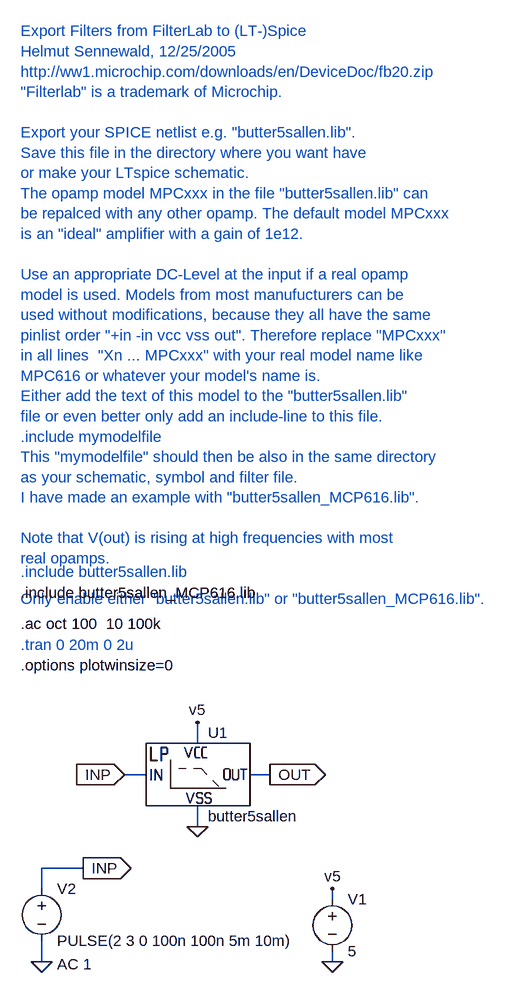
[diagram p0: schematic MC_filterlab__lp1khz.asc]
MC_filterlab__lp1khz.asc, the LTspice schematic file:
Version 4
SHEET 1 880 680
WIRE -112 416 -112 384
WIRE -112 528 -112 496
WIRE -48 384 -112 384
WIRE 48 240 16 240
WIRE 128 192 128 160
WIRE 128 320 128 288
WIRE 240 240 208 240
WIRE 336 432 336 416
WIRE 336 528 336 512
FLAG 128 320 0
FLAG 336 528 0
FLAG 128 160 v5
FLAG 336 416 v5
FLAG 240 240 OUT
IOPIN 240 240 Out
FLAG -112 528 0
FLAG 16 240 INP
IOPIN 16 240 In
FLAG -48 384 INP
IOPIN -48 384 Out
SYMBOL lp_block 96 240 R0
SYMATTR Value butter5sallen
SYMATTR InstName U1
SYMBOL voltage 336 416 R0
SYMATTR InstName V1
SYMATTR Value 5
SYMBOL voltage -112 400 R0
WINDOW 123 24 132 Left 0
WINDOW 39 0 0 Left 0
SYMATTR Value2 AC 1
SYMATTR InstName V2
SYMATTR Value PULSE(2 3 0 100n 100n 5m 10m)
TEXT -144 8 Left 0 !.ac oct 100  10 100k
TEXT -144 -72 Left 0 ;.include butter5sallen.lib
TEXT -144 -904 Left 0 ;Export Filters from FilterLab to (LT-)Spice\nHelmut Sennewald, 12/25/2005\nhttp://ww1.microchip.com/downloads/en/DeviceDoc/fb20.zip\n"Filterlab" is a trademark of Microchip.\n \nExport your SPICE netlist e.g. "butter5sallen.lib".\nSave this file in the directory where you want have \nor make your LTspice schematic.\nThe opamp model MPCxxx in the file "butter5sallen.lib" can \nbe repalced with any other opamp. The default model MPCxxx \nis an "ideal" amplifier with a gain of 1e12.\n \nUse an appropriate DC-Level at the input if a real opamp \nmodel is used. Models from most manufucturers can be\nused without modifications, because they all have the same\npinlist order "+in -in vcc vss out". Therefore replace "MPCxxx"\nin all lines  "Xn ... MPCxxx" with your real model name like \nMPC616 or whatever your model's name is.\nEither add the text of this model to the "butter5sallen.lib" \nfile or even better only add an include-line to this file.\n.include mymodelfile\nThis "mymodelfile" should then be also in the same directory \nas your schematic, symbol and filter file.\nI have made an example with "butter5sallen_MCP616.lib".\n \nNote that V(out) is rising at high frequencies with most \nreal opamps.\n \nOnly enable either "butter5sallen.lib" or "butter5sallen_MCP616.lib".
TEXT -144 40 Left 0 ;.tran 0 20m 0 2u
TEXT -144 72 Left 0 !.options plotwinsize=0
TEXT -144 -40 Left 0 !.include butter5sallen_MCP616.lib

The netlist it stands for:
* MC_filterlab__lp1khz.asc
XU1 INP OUT v5 0 butter5sallen  ; pins IN OUT VCC VSS
V1 v5 0 5
V2 INP 0 PULSE(2 3 0 100n 100n 5m 10m) AC 1
.ac oct 100  10 100k
* .include butter5sallen.lib
* Export Filters from FilterLab to (LT-)Spice
* Helmut Sennewald, 12/25/2005
* http://ww1.microchip.com/downloads/en/DeviceDoc/fb20.zip
* "Filterlab" is a trademark of Microchip.
* Export your SPICE netlist e.g. "butter5sallen.lib".
* Save this file in the directory where you want have
* or make your LTspice schematic.
* The opamp model MPCxxx in the file "butter5sallen.lib" can
* be repalced with any other opamp. The default model MPCxxx
* is an "ideal" amplifier with a gain of 1e12.
* Use an appropriate DC-Level at the input if a real opamp
* model is used. Models from most manufucturers can be
* used without modifications, because they all have the same
* pinlist order "+in -in vcc vss out". Therefore replace "MPCxxx"
* in all lines  "Xn ... MPCxxx" with your real model name like
* MPC616 or whatever your model's name is.
* Either add the text of this model to the "butter5sallen.lib"
* file or even better only add an include-line to this file.
* .include mymodelfile
* This "mymodelfile" should then be also in the same directory
* as your schematic, symbol and filter file.
* I have made an example with "butter5sallen_MCP616.lib".
* Note that V(out) is rising at high frequencies with most
* real opamps.
* Only enable either "butter5sallen.lib" or "butter5sallen_MCP616.lib".
* .tran 0 20m 0 2u
.options plotwinsize=0
.include butter5sallen_MCP616.lib
.backanno
.end